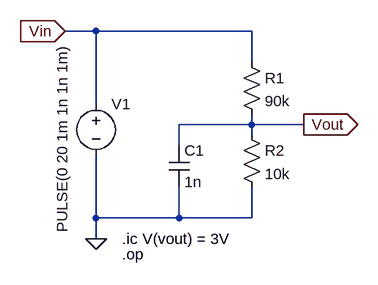
[diagram p0: schematic Voltage Divider wih RC Filter DC Op.asc]
Voltage Divider wih RC Filter DC Op.asc, the LTspice schematic file:
Version 4
SHEET 1 880 680
WIRE 112 96 64 96
WIRE 352 96 112 96
WIRE 352 144 352 96
WIRE 112 208 112 96
WIRE 352 240 352 224
WIRE 352 240 240 240
WIRE 432 240 352 240
WIRE 352 256 352 240
WIRE 240 272 240 240
WIRE 112 384 112 288
WIRE 240 384 240 336
WIRE 240 384 112 384
WIRE 352 384 352 336
WIRE 352 384 240 384
WIRE 112 416 112 384
FLAG 112 416 0
FLAG 432 240 Vout
IOPIN 432 240 Out
FLAG 64 96 Vin
IOPIN 64 96 In
SYMBOL voltage 112 192 R0
WINDOW 3 -52 -76 VRight 2
WINDOW 123 0 0 Left 0
WINDOW 39 0 0 Left 0
SYMATTR InstName V1
SYMATTR Value PULSE(0 20 1m 1n 1n 1m)
SYMBOL res 336 128 R0
SYMATTR InstName R1
SYMATTR Value 90k
SYMBOL res 336 240 R0
SYMATTR InstName R2
SYMATTR Value 10k
SYMBOL cap 224 272 R0
SYMATTR InstName C1
SYMATTR Value 1n
TEXT 152 440 Left 2 !.op
TEXT 152 416 Left 2 !.ic V(vout) = 3V

The netlist it stands for:
* Voltage Divider wih RC Filter DC Op.asc
V1 Vin 0 PULSE(0 20 1m 1n 1n 1m)
R1 Vin Vout 90k
R2 Vout 0 10k
C1 Vout 0 1n
.op
.ic V(vout) = 3V
.backanno
.end